# Altium schematic sheet aria_g25.SchDoc
size A3
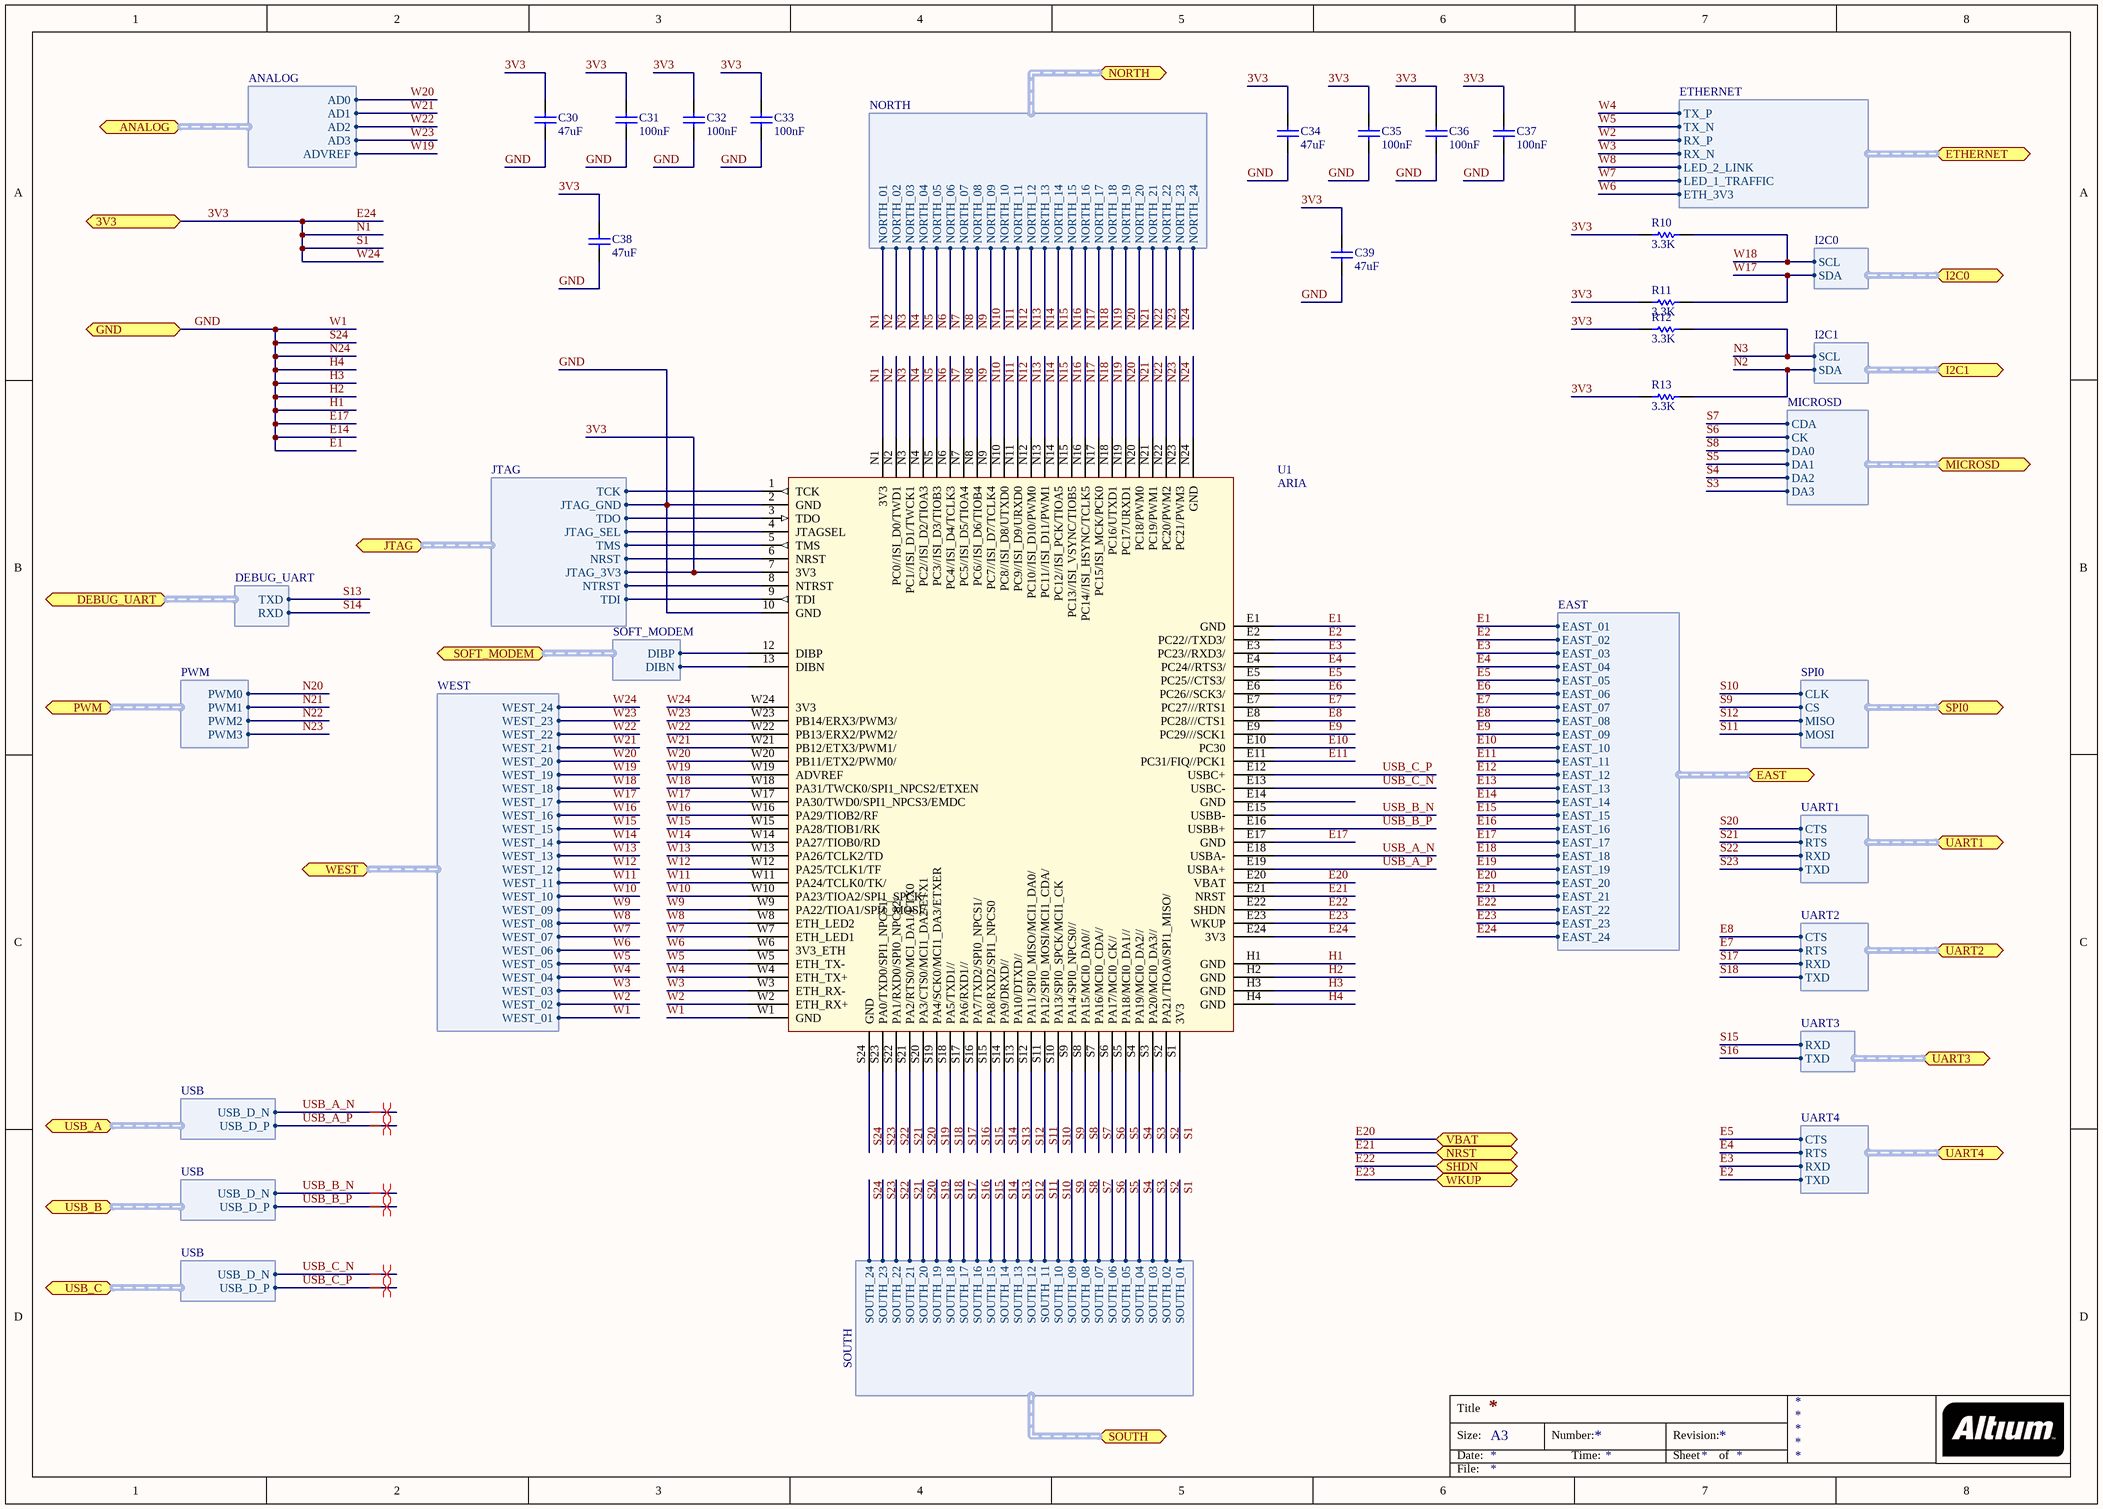
[diagram p0: aria_g25.SchDoc]

## Parts
C30  value 47uF  [0805]  (hidden comment: CAP)
C31  value 100nF  [0805]  (hidden comment: CAP)
C32  value 100nF  [0805]  (hidden comment: CAP)
C33  value 100nF  [0805]  (hidden comment: CAP)
C34  value 47uF  [0805]  (hidden comment: CAP)
C35  value 100nF  [0805]  (hidden comment: CAP)
C36  value 100nF  [0805]  (hidden comment: CAP)
C37  value 100nF  [0805]  (hidden comment: CAP)
C38  value 47uF  [0805]  (hidden comment: CAP)
C39  value 47uF  [0805]  (hidden comment: CAP)
R10  value 3.3K  [0805]  (hidden comment: RES)
R11  value 3.3K  [0805]  (hidden comment: RES)
R12  value 3.3K  [0805]  (hidden comment: RES)
R13  value 3.3K  [0805]  (hidden comment: RES)
U1  ARIA  [AB ARIA 1]

## Ports
3V3, ANALOG (harness ANALOG), DEBUG_UART (harness DEBUG_UART), EAST (harness EAST), ETHERNET (harness ETHERNET), GND, I2C0 (harness I2C0), I2C1 (harness I2C1), JTAG (harness JTAG), MICROSD (harness MICROSD), NORTH (harness NORTH), NRST, PWM (harness PWM), SHDN, SOFT_MODEM (harness SOFT_MODEM), SOUTH (harness SOUTH), SPI0 (harness SPI0), UART1 (harness UART1), UART2 (harness UART2), UART3 (harness UART3), UART4 (harness UART4), USB_A (harness USB), USB_B (harness USB), USB_C (harness USB), VBAT, WEST (harness WEST), WKUP

## Harnesses
NORTH: NORTH_01, NORTH_02, NORTH_03, NORTH_04, NORTH_05, NORTH_06, NORTH_07, NORTH_08, NORTH_09, NORTH_10, NORTH_11, NORTH_12, NORTH_13, NORTH_14, NORTH_15, NORTH_16, NORTH_17, NORTH_18, NORTH_19, NORTH_20, NORTH_21, NORTH_22, NORTH_23, NORTH_24
EAST: EAST_01, EAST_02, EAST_03, EAST_04, EAST_05, EAST_06, EAST_07, EAST_08, EAST_09, EAST_10, EAST_11, EAST_12, EAST_13, EAST_14, EAST_15, EAST_16, EAST_17, EAST_18, EAST_19, EAST_20, EAST_21, EAST_22, EAST_23, EAST_24
SOUTH: SOUTH_01, SOUTH_02, SOUTH_03, SOUTH_04, SOUTH_05, SOUTH_06, SOUTH_07, SOUTH_08, SOUTH_09, SOUTH_10, SOUTH_11, SOUTH_12, SOUTH_13, SOUTH_14, SOUTH_15, SOUTH_16, SOUTH_17, SOUTH_18, SOUTH_19, SOUTH_20, SOUTH_21, SOUTH_22, SOUTH_23, SOUTH_24
WEST: WEST_01, WEST_02, WEST_03, WEST_04, WEST_05, WEST_06, WEST_07, WEST_08, WEST_09, WEST_10, WEST_11, WEST_12, WEST_13, WEST_14, WEST_15, WEST_16, WEST_17, WEST_18, WEST_19, WEST_20, WEST_21, WEST_22, WEST_23, WEST_24
ANALOG: AD0, AD1, AD2, AD3, ADVREF
DEBUG_UART: RXD, TXD
ETHERNET: ETH_3V3, LED_1_TRAFFIC, LED_2_LINK, RX_N, RX_P, TX_N, TX_P
I2C0: SCL, SDA
I2C1: SCL, SDA
MICROSD: CDA, CK, DA0, DA1, DA2, DA3
SOFT_MODEM: DIBN, DIBP
SPI0: CLK, CS, MISO, MOSI
UART1: CTS, RTS, RXD, TXD
UART2: CTS, RTS, RXD, TXD
UART3: RXD, TXD
UART4: CTS, RTS, RXD, TXD
JTAG: JTAG_3V3, JTAG_GND, JTAG_SEL, NRST, NTRST, TCK, TDI, TDO, TMS
PWM: PWM0, PWM1, PWM2, PWM3
USB: USB_D_N, USB_D_P

## Nets
3V3: C30.2 C31.2 C32.2 C33.2 C34.2 C35.2 C36.2 C37.2 C38.2 C39.2 R10.2 R11.2 R12.2 R13.2 U1.7(3V3) U1.E24(3V3) U1.N1(3V3) U1.S1(3V3) U1.W24(3V3) ; port 3V3, port NORTH.NORTH_01, port EAST.EAST_24, port SOUTH.SOUTH_01, port WEST.WEST_24, port JTAG.JTAG_3V3  [also labelled E24, N1, S1, W24]
E1: C30.1 C31.1 C32.1 C33.1 C34.1 C35.1 C36.1 C37.1 C38.1 C39.1 U1.2(GND) U1.10(GND) U1.E1(GND) U1.E17(GND) U1.H1(GND) U1.H2(GND) U1.H3(GND) U1.H4(GND) U1.N24(GND) U1.S24(GND) U1.W1(GND) ; port GND, port NORTH.NORTH_24, port EAST.EAST_01, port EAST.EAST_14, port EAST.EAST_17, port SOUTH.SOUTH_24, port WEST.WEST_01, port JTAG.JTAG_GND  [also labelled E14, E17, GND, H1, H2, H3, H4, N24, S24, W1]
E2: U1.E2(PC22//TXD3/) ; port EAST.EAST_02, port UART4.TXD
E3: U1.E3(PC23//RXD3/) ; port EAST.EAST_03, port UART4.RXD
E4: U1.E4(PC24//RTS3/) ; port EAST.EAST_04, port UART4.RTS
E5: U1.E5(PC25//CTS3/) ; port EAST.EAST_05, port UART4.CTS
E6: U1.E6(PC26//SCK3/) ; port EAST.EAST_06
E7: U1.E7(PC27///RTS1) ; port EAST.EAST_07, port UART2.RTS
E8: U1.E8(PC28///CTS1) ; port EAST.EAST_08, port UART2.CTS
E9: U1.E9(PC29///SCK1) ; port EAST.EAST_09
E10: U1.E10(PC30) ; port EAST.EAST_10
E11: U1.E11(PC31/FIQ//PCK1) ; port EAST.EAST_11
E12: port EAST.EAST_12
E13: port EAST.EAST_13
E15: port EAST.EAST_15
E16: port EAST.EAST_16
E18: port EAST.EAST_18
E19: port EAST.EAST_19
E20: U1.E20(VBAT) ; port VBAT, port EAST.EAST_20
E21: U1.E21(NRST) ; port NRST, port EAST.EAST_21
E22: U1.E22(SHDN) ; port SHDN, port EAST.EAST_22
E23: U1.E23(WKUP) ; port WKUP, port EAST.EAST_23
N2: R13.1 U1.N2(PC0//ISI_D0/TWD1) ; port NORTH.NORTH_02, port I2C1.SDA
N3: R12.1 U1.N3(PC1//ISI_D1/TWCK1) ; port NORTH.NORTH_03, port I2C1.SCL
N4: U1.N4(PC2//ISI_D2/TIOA3) ; port NORTH.NORTH_04
N5: U1.N5(PC3//ISI_D3/TIOB3) ; port NORTH.NORTH_05
N6: U1.N6(PC4//ISI_D4/TCLK3) ; port NORTH.NORTH_06
N7: U1.N7(PC5//ISI_D5/TIOA4) ; port NORTH.NORTH_07
N8: U1.N8(PC6//ISI_D6/TIOB4) ; port NORTH.NORTH_08
N9: U1.N9(PC7//ISI_D7/TCLK4) ; port NORTH.NORTH_09
N10: U1.N10(PC8//ISI_D8/UTXD0) ; port NORTH.NORTH_10
N11: U1.N11(PC9//ISI_D9/URXD0) ; port NORTH.NORTH_11
N12: U1.N12(PC10//ISI_D10/PWM0) ; port NORTH.NORTH_12
N13: U1.N13(PC11//ISI_D11/PWM1) ; port NORTH.NORTH_13
N14: U1.N14(PC12//ISI_PCK/TIOA5) ; port NORTH.NORTH_14
N15: U1.N15(PC13//ISI_VSYNC/TIOB5) ; port NORTH.NORTH_15
N16: U1.N16(PC14//ISI_HSYNC/TCLK5) ; port NORTH.NORTH_16
N17: U1.N17(PC15/ISI_MCK/PCK0) ; port NORTH.NORTH_17
N18: U1.N18(PC16/UTXD1) ; port NORTH.NORTH_18
N19: U1.N19(PC17/URXD1) ; port NORTH.NORTH_19
N20: U1.N20(PC18/PWM0) ; port NORTH.NORTH_20, port PWM.PWM0
N21: U1.N21(PC19/PWM1) ; port NORTH.NORTH_21, port PWM.PWM1
N22: U1.N22(PC20/PWM2) ; port NORTH.NORTH_22, port PWM.PWM2
N23: U1.N23(PC21/PWM3) ; port NORTH.NORTH_23, port PWM.PWM3
S2: U1.S2(PA21/TIOA0/SPI1_MISO/) ; port SOUTH.SOUTH_02
S3: U1.S3(PA20/MCI0_DA3//) ; port SOUTH.SOUTH_03, port MICROSD.DA3
S4: U1.S4(PA19/MCI0_DA2//) ; port SOUTH.SOUTH_04, port MICROSD.DA2
S5: U1.S5(PA18/MCI0_DA1//) ; port SOUTH.SOUTH_05, port MICROSD.DA1
S6: U1.S6(PA17/MCI0_CK//) ; port SOUTH.SOUTH_06, port MICROSD.CK
S7: U1.S7(PA16/MCI0_CDA//) ; port SOUTH.SOUTH_07, port MICROSD.CDA
S8: U1.S8(PA15/MCI0_DA0//) ; port SOUTH.SOUTH_08, port MICROSD.DA0
S9: U1.S9(PA14/SPI0_NPCS0//) ; port SOUTH.SOUTH_09, port SPI0.CS
S10: U1.S10(PA13/SPI0_SPCK/MCI1_CK) ; port SOUTH.SOUTH_10, port SPI0.CLK
S11: U1.S11(PA12/SPI0_MOSI/MCI1_CDA/) ; port SOUTH.SOUTH_11, port SPI0.MOSI
S12: U1.S12(PA11/SPI0_MISO/MCI1_DA0/) ; port SOUTH.SOUTH_12, port SPI0.MISO
S13: U1.S13(PA10/DTXD//) ; port SOUTH.SOUTH_13, port DEBUG_UART.TXD
S14: U1.S14(PA9/DRXD//) ; port SOUTH.SOUTH_14, port DEBUG_UART.RXD
S15: U1.S15(PA8/RXD2/SPI1_NPCS0) ; port SOUTH.SOUTH_15, port UART3.RXD
S16: U1.S16(PA7/TXD2/SPI0_NPCS1/) ; port SOUTH.SOUTH_16, port UART3.TXD
S17: U1.S17(PA6/RXD1//) ; port SOUTH.SOUTH_17, port UART2.RXD
S18: U1.S18(PA5/TXD1//) ; port SOUTH.SOUTH_18, port UART2.TXD
S19: U1.S19(PA4/SCK0/MCI1_DA3/ETXER) ; port SOUTH.SOUTH_19
S20: U1.S20(PA3/CTS0/MCI1_DA2/ETX1) ; port SOUTH.SOUTH_20, port UART1.CTS
S21: U1.S21(PA2/RTS0/MCI_DA1/ETX0) ; port SOUTH.SOUTH_21, port UART1.RTS
S22: U1.S22(PA1/RXD0/SPI0_NPCS2/) ; port SOUTH.SOUTH_22, port UART1.RXD
S23: U1.S23(PA0/TXD0/SPI1_NPCS1/) ; port SOUTH.SOUTH_23, port UART1.TXD
USB_A_N: U1.E18(USBA-) ; port USB_A.USB_D_N
USB_A_P: U1.E19(USBA+) ; port USB_A.USB_D_P
USB_B_N: U1.E15(USBB-) ; port USB_B.USB_D_N
USB_B_P: U1.E16(USBB+) ; port USB_B.USB_D_P
USB_C_N: U1.E13(USBC-) ; port USB_C.USB_D_N
USB_C_P: U1.E12(USBC+) ; port USB_C.USB_D_P
W2: U1.W2(ETH_RX+) ; port WEST.WEST_02, port ETHERNET.RX_P
W3: U1.W3(ETH_RX-) ; port WEST.WEST_03, port ETHERNET.RX_N
W4: U1.W4(ETH_TX+) ; port WEST.WEST_04, port ETHERNET.TX_P
W5: U1.W5(ETH_TX-) ; port WEST.WEST_05, port ETHERNET.TX_N
W6: U1.W6(3V3_ETH) ; port WEST.WEST_06, port ETHERNET.ETH_3V3
W7: U1.W7(ETH_LED1) ; port WEST.WEST_07, port ETHERNET.LED_1_TRAFFIC
W8: U1.W8(ETH_LED2) ; port WEST.WEST_08, port ETHERNET.LED_2_LINK
W9: U1.W9(PA22/TIOA1/SPI1_MOSI/) ; port WEST.WEST_09
W10: U1.W10(PA23/TIOA2/SPI1_SPCK/) ; port WEST.WEST_10
W11: U1.W11(PA24/TCLK0/TK/) ; port WEST.WEST_11
W12: U1.W12(PA25/TCLK1/TF) ; port WEST.WEST_12
W13: U1.W13(PA26/TCLK2/TD) ; port WEST.WEST_13
W14: U1.W14(PA27/TIOB0/RD) ; port WEST.WEST_14
W15: U1.W15(PA28/TIOB1/RK) ; port WEST.WEST_15
W16: U1.W16(PA29/TIOB2/RF) ; port WEST.WEST_16
W17: R11.1 U1.W17(PA30/TWD0/SPI1_NPCS3/EMDC) ; port WEST.WEST_17, port I2C0.SDA
W18: R10.1 U1.W18(PA31/TWCK0/SPI1_NPCS2/ETXEN) ; port WEST.WEST_18, port I2C0.SCL
W19: U1.W19(ADVREF) ; port WEST.WEST_19, port ANALOG.ADVREF
W20: U1.W20(PB11/ETX2/PWM0/) ; port WEST.WEST_20, port ANALOG.AD0
W21: U1.W21(PB12/ETX3/PWM1/) ; port WEST.WEST_21, port ANALOG.AD1
W22: U1.W22(PB13/ERX2/PWM2/) ; port WEST.WEST_22, port ANALOG.AD2
W23: U1.W23(PB14/ERX3/PWM3/) ; port WEST.WEST_23, port ANALOG.AD3
NetU1_1: U1.1(TCK) ; port JTAG.TCK
NetU1_3: U1.3(TDO) ; port JTAG.TDO
NetU1_4: U1.4(JTAGSEL) ; port JTAG.JTAG_SEL
NetU1_5: U1.5(TMS) ; port JTAG.TMS
NetU1_6: U1.6(NRST) ; port JTAG.NRST
NetU1_8: U1.8(NTRST) ; port JTAG.NTRST
NetU1_9: U1.9(TDI) ; port JTAG.TDI
NetU1_12: U1.12(DIBP) ; port SOFT_MODEM.DIBP
NetU1_13: U1.13(DIBN) ; port SOFT_MODEM.DIBN

Not connected (* = marked no-connect by the designer): U1 E14(GND)

## Layout directives
differential pair: USB_A_N, USB_A_P, USB_B_N, USB_B_P, USB_C_N, USB_C_P

## Notes on the sheet
- Title
- Size:
- Date:
- A3
- Number:
- Time:
- Revision:
- Sheet
- of
- File:

## Library data of the parts
C30-C39 = CAP: Tolerance: 5%; Voltage: 10V; Manufacturer: *; Manufacturer P/N: *; Tr: *; Distributor: Digi-Key; Distributor P/N: *
U1 = ARIA: Manufacturer: Acme Systems; Manufacturer P/N: Aria G25; Distributor: Acme Systems; Distributor P/N: Aria G25
R10-R13 = RES: Tcr: *; Tolerance: *; Manufacturer: *; Manufacturer P/N: *; Tr: *; Alternatives: *; Voltage: *; Power: *; Distributor: Digi-Key; Distributor P/N: *